# Altium project Medicop.PrjPcb
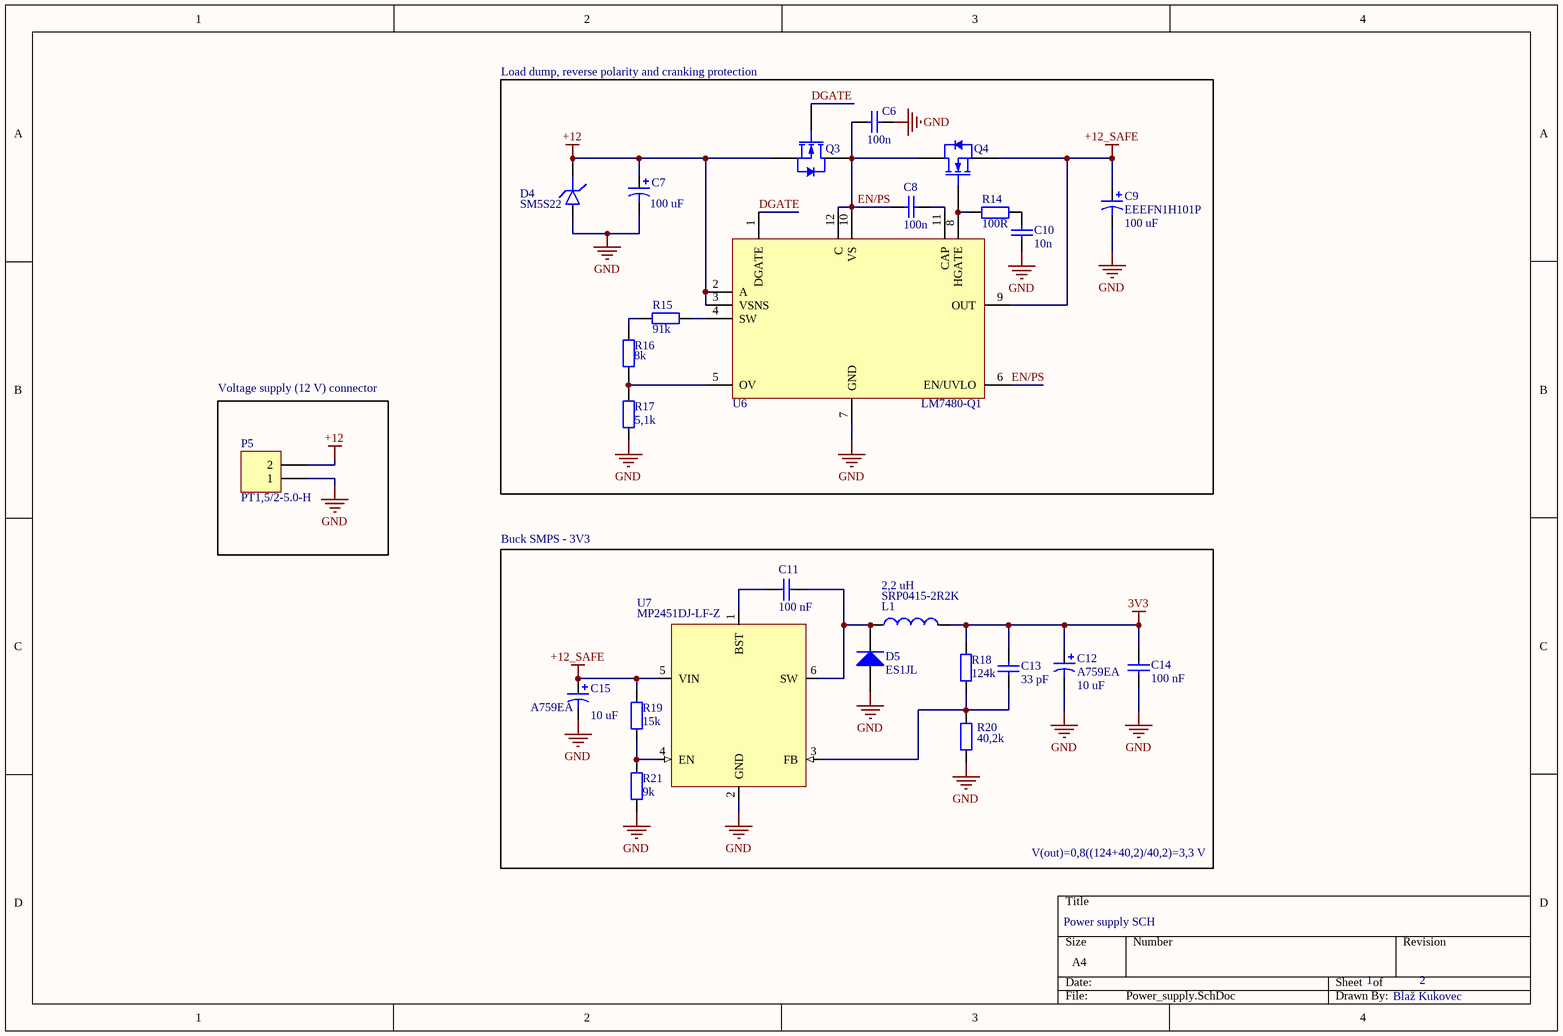
[diagram p0: Power_supply.SchDoc]
2 sheets, 59 parts. Net scope: global (net labels, ports and power ports of the same name join across sheets).
Sheets:
  Power_supply.SchDoc
  Medicop_Schematic.SchDoc

## Sheet Power_supply.SchDoc
size A4

### Parts
C6  value 100n  [C0603[1608]]  (hidden comment: Cap)
C7  value 100 uF  [CAP_FN_F_PAN]  (hidden comment: EEEFN1H101P)
C8  value 100n  [C0603[1608]]  (hidden comment: Cap)
C9  EEEFN1H101P  value 100 uF  [CAP_FN_F_PAN]
C10  value 10n  [C0603[1608]]  (hidden comment: Cap)
C11  value 100 nF  [C0603[1608]]  (hidden comment: Cap)
C12  A759EA  value 10 uF  [A759EA]
C13  value 33 pF  [C0603[1608]]  (hidden comment: Cap)
C14  value 100 nF  [C0603[1608]]  (hidden comment: Cap)
C15  A759EA  value 10 uF  [A759EA]
D4  SM5S22  [DO-218AB_SM_VIS]
D5  ES1JL  [Sub-SMA]
L1  SRP0415-2R2K  value 2,2 uH  [SRP0415]
P5  PT1,5/2-5.0-H  [PT1,5/2-5.0-H]
Q3  BUK7Y4R8-60EX  [SOT669]  (value not drawn)
Q4  BUK7Y4R8-60EX  [SOT669]  (value not drawn)
R14  value 100R  [0603R-GENERIC]  (hidden comment: Res)
R15  value 91k  [R0603[1608]]  (hidden comment: Res)
R16  value 8k  [R0603[1608]]  (hidden comment: Res)
R17  value 5,1k  [R0603[1608]]  (hidden comment: Res)
R18  value 124k  [0603R-GENERIC]  (hidden comment: Res)
R19  value 15k  [R0603[1608]]  (hidden comment: Res)
R20  value 40,2k  [0603R-GENERIC]  (hidden comment: Res)
R21  value 9k  [R0603[1608]]  (hidden comment: Res)
U6  LM7480-Q1  [WSON12]
U7  MP2451DJ-LF-Z  [TSOT-23-6]

### Blocks framed on the sheet
Load dump, reverse polarity and cranking protection: C6-C10 D4 Q3 Q4 R14-R17 U6
Voltage supply (12 V) connector: P5

### Nets
3V3: C12.1 C13.2 C14.2 L1.2 R18.1
+12: C7.1 D4.K P5.2 Q3.3(S) U6.2(A) U6.3(VSNS)
+12_SAFE: C9.1 C15.1 Q4.3(S) R19.2 U6.9(OUT) U7.5(VIN)
GND: C6.1 C7.2 C9.2 C10.1 C12.2 C14.1 C15.2 D4.A D5.1(A) P5.1 R17.1 R20.1 R21.1 U6.7(GND) U7.2(GND)
DGATE: Q3.1(G) U6.1(DGATE)
EN/PS: C6.2 C8.1 Q3.2(D) Q4.2(D) U6.6(EN/UVLO) U6.10(VS) U6.12(C)
NetC8_2: C8.2 U6.11(CAP)
NetC10_2: C10.2 R14.2
NetC11_1: C11.1 D5.2(K) L1.1 U7.6(SW)
NetC11_2: C11.2 U7.1(BST)
NetC13_1: C13.1 R18.2 R20.2 U7.3(FB)
NetQ4_1: Q4.1(G) R14.1 U6.8(HGATE)
NetR15_1: R15.1 U6.4(SW)
NetR15_2: R15.2 R16.2
NetR16_1: R16.1 R17.2 U6.5(OV)
NetR19_1: R19.1 R21.2 U7.4(EN)

### Notes on the sheet
- Buck SMPS - 3V3
- V(out)=0,8((124+40,2)/40,2)=3,3 V
- Power supply SCH
- 1
- 2
- Blaž Kukovec

### Library data of the parts
C6 C8 C10 C11 C13 C14 = Cap: Capacitor; ComponentLink1Description: Supplierlink; ComponentLink2Description: Datasheet
C7 C9 = EEEFN1H101P: SMD Aluminium Electrolytic Capacitor, Radial Can - SMD, 100 µF, 50 V, 0.34 ohm; PacketDescription: TH; ComponentLink1Description: SupplierLink; ComponentLink1URL: https://si.farnell.com/panasonic/eeefn1h101p/cap-100uf-50v-alu-elec-smd/dp/3386217; ComponentLink2Description: Datasheet; ComponentLink2URL: https://www.farnell.com/datasheets/2939503.pdf; Supplier1: Farnell; SupplierPartNumber1: 3386217
C12 C15 = A759EA106M1JAAE060: A759EA106M1JAAE060 - Capacitor - 10 µF - 63 V - Low ESR (60m); PacketDescription: TH; ComponentLink1Description: SupplierLink; ComponentLink1URL: https://si.farnell.com/kemet/a759ea106m1jaae060/cap-10uf-63v-alu-polymer-radial/dp/4071156; ComponentLink2Description: Datasheet; ComponentLink2URL: https://content.kemet.com/datasheets/KEM_A4072_A759.pdf; Supplier1: Farnell; SupplierPartNumber1: 4071156
D4 = SM5S22ATHE3/I: ESD Suppressors / TVS Diodes 5W,22V 5%,SMD PAR AEC-Q101 Qualified; ComponentLink1Description: Supplierlink; PackageDescription: PowerDI123; ComponentLink1URL: https://eu.mouser.com/ProductDetail/Vishay-General-Semiconductor/SM5S22ATHE3-I?qs=Vcr9%2FL0R50gQwdAZT2MpLw%3D%3D; ComponentLink2Description: Datasheet; ComponentLink2URL: https://www.vishay.com/docs/87609/sm5s10atthrusm5s36at.pdf; Supplier1: Mouser; SupplierPartNumber1: 78-SM5S22ATHE3/I
D5 = ES1JL: Ultrafast Diode; ComponentLink1Description: Supplierlink; PackageDescription: Sub SMA; ComponentLink1URL: https://www.tme.eu/sl/details/es1jl/univerzalne-smd-diode/taiwan-semiconductor/; ComponentLink2Description: Datasheet; ComponentLink2URL: https://www.tme.eu/sl/Document/6e3ed172b8ef57eec12ad172948b8283/ES1JL-DTE.pdf; Supplier1: TME; SupplierPartNumber1: https://www.tme.eu/sl/details/es1jl/univerzalne-smd-diode/taiwan-semiconductor/
L1 = SRP0415-2R2K: Power Inductor (SMD), 2.2 µH, 4.2 A, Shielded, 6.5 A, SRP0415; ComponentLink1Description: Supplierlink; PackageDescription: 4,1 x 4,4 mm; ComponentLink1URL: https://si.farnell.com/bourns/srp0415-2r2k/inductor-2-2uh-shielded-4-2a/dp/3410557?st=srp0415-2r2k; ComponentLink2Description: Datasheet; ComponentLink2URL: http://www.farnell.com/datasheets/1780639.pdf?_ga=1.11763974http://www.farnell.com/datasheets/1870377.pdf?_ga=2.97039455.1713077709.1510607325-537448299.1510088633&_gac=1.187392858.1510611497.CjwKCAiAoqXQBRA8EiwAIIOWsuqxOSeUt0rc_qHWWY-BiEXPlEM73fxauWSkJ-z_Lq9BZTEckF83wRoCiNIQAvD_BwE5.938531117.1476279422; Supplier1: Farnell; SupplierPartNumber1: 3410557
P5 = PT1,5/2-5.0-H: Wire-To-Board Terminal Block, 5 mm, 2 Ways, 1.5 mm²; ComponentLink1Description: SupplierLink; ComponentLink1URL: https://si.farnell.com/phoenix-contact/pt1-5-2-5-0-h/terminal-block-wire-to-brd-2pos/dp/1793674?st=pt1,5; ComponentLink2Description: Datasheet; ComponentLink2URL: http://www.farnell.com/datasheets/2325505.pdf; Supplier1: Farnell; SupplierPartNumber1: 1793674
Q3 Q4 = BUK7Y4R8-60EX: Power MOSFET, N Channel, 60 V, 100 A, 0.0029 ohm, LFPAK56, Surface Mount; ComponentLink1Description: Supplierlink; PackageDescription: SOT669; ComponentLink1URL: https://si.farnell.com/nexperia/buk7y4r8-60ex/mosfet-aecq101-n-ch-60v-100a-lfpak56/dp/3439679?st=buk7y4r8-60e; ComponentLink2Description: Datasheet; ComponentLink2URL: https://4donline.ihs.com/images/VipMasterIC/IC/NEXP/NEXP-S-A0003060256/NEXP-S-A0003059997-1.pdf?hkey=6D3A4C79FDBF58556ACFDE234799DDF0; Supplier1: Farnell; SupplierPartNumber1: 3439679
R14-R21 = Res: Resistor; ComponentLink1Description: Supplierlink; ComponentLink2Description: Datasheet
U6 = LM7480-Q1: Power Management Specialised - PMIC 3-V to 65-V, automotive ideal diode controller driving back to back NFETs 12-WSON -40 to 125; ComponentLink1Description: Supplierlink; PackageDescription: WSON-12; ComponentLink1URL: https://eu.mouser.com/ProductDetail/Texas-Instruments/LM74801QDRRRQ1?qs=zW32dvEIR3uHxOfYWHY8FQ%3D%3D; ComponentLink2Description: Datasheet; ComponentLink2URL: https://www.ti.com/lit/ds/symlink/lm7480-q1.pdf?HQS=dis-mous-null-mousermode-dsf-pf-null-wwe&ts=1693805776578&ref_url=https%253A%252F%252Fwww.mouser.cn%252F; Supplier1: Mouser; SupplierPartNumber1: 595-LM74801QDRRRQ1
U7 = MP2451DJ-LF-Z: DC-DC Switching Buck (Step Down) Regulator, 3.3V-36V in, 800mV to 28.8V out, 600mA, 2MHz, TSOT-23-6; ComponentLink1Description: Supplierlink; PackageDescription: TSOT-23-6; ComponentLink1URL: https://si.farnell.com/monolithic-power-systems-mps/mp2451dj-lf-z/dc-dc-conv-sync-buck-2mhz-125degc/dp/3357997; ComponentLink2Description: Datasheet; ComponentLink2URL: https://www.farnell.com/datasheets/2914802.pdf; Supplier1: Farnell; SupplierPartNumber1: 3357997

## Sheet Medicop_Schematic.SchDoc
size A4
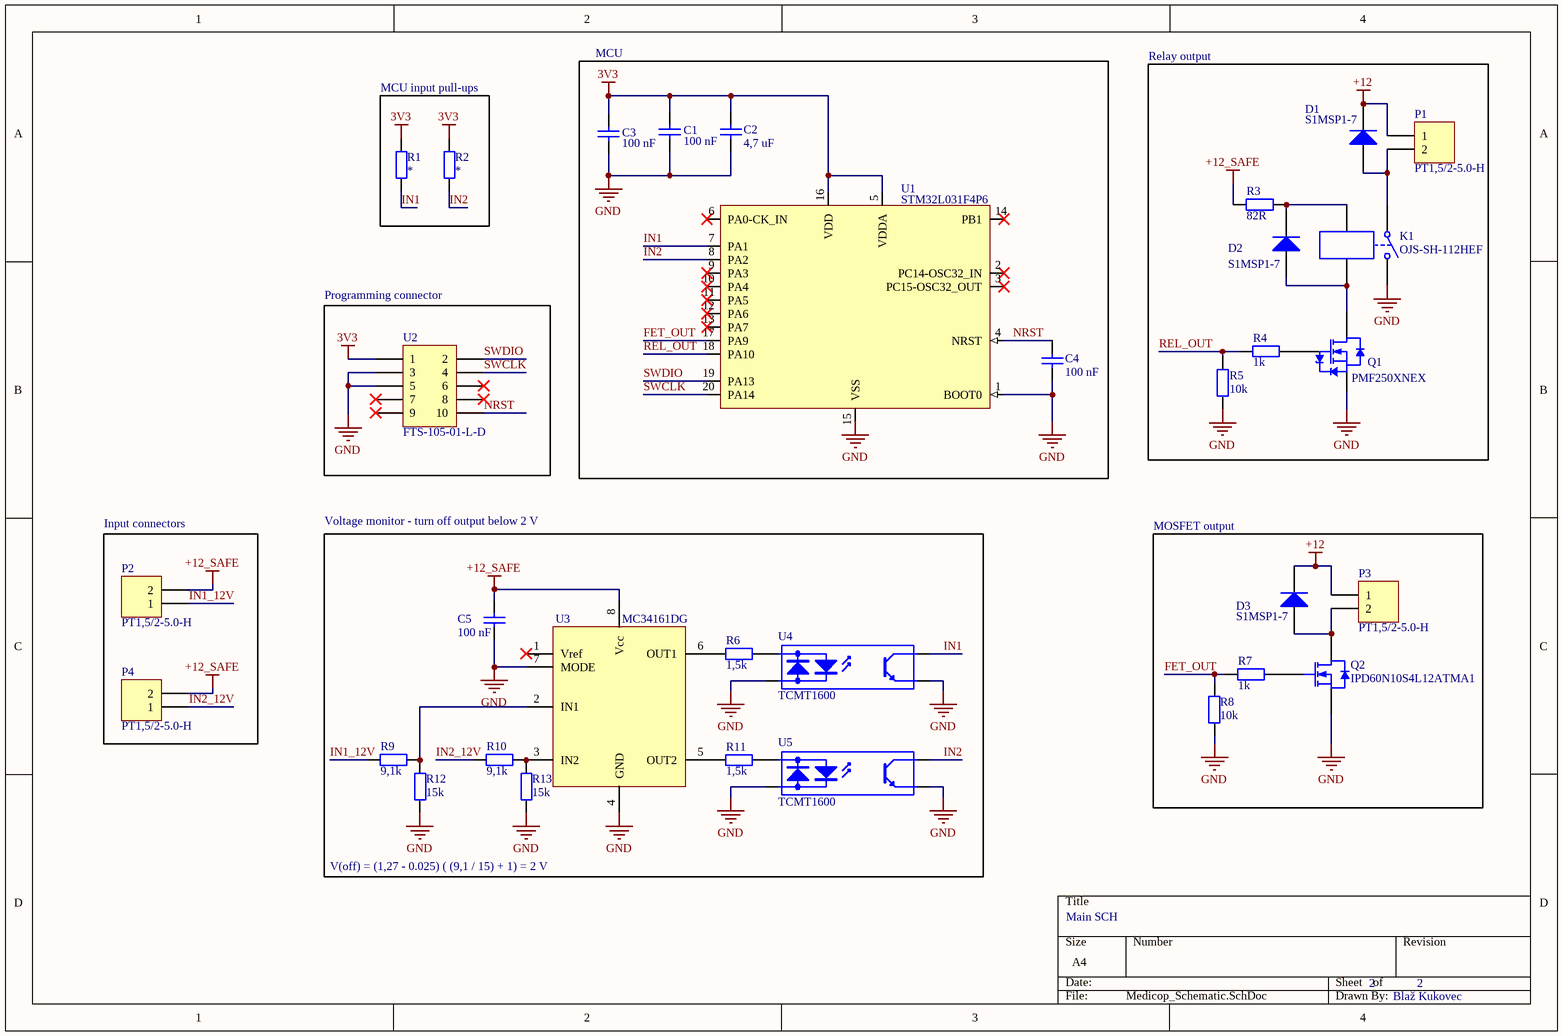
[diagram p1: Medicop_Schematic.SchDoc]

### Parts
C1  value 100 nF  [C0603[1608]]  (hidden comment: Cap)
C2  value 4,7 uF  [C0603[1608]]  (hidden comment: Cap)
C3  value 100 nF  [C0603[1608]]  (hidden comment: Cap)
C4  value 100 nF  [C0603[1608]]  (hidden comment: Cap)
C5  value 100 nF  [C0603[1608]]  (hidden comment: Cap)
D1  S1MSP1-7  [PowerDI123]
D2  S1MSP1-7  [PowerDI123]
D3  S1MSP1-7  [PowerDI123]
K1  OJS-SH-112HEF
P1  PT1,5/2-5.0-H  [PT1,5/2-5.0-H]
P2  PT1,5/2-5.0-H  [PT1,5/2-5.0-H]
P3  PT1,5/2-5.0-H  [PT1,5/2-5.0-H]
P4  PT1,5/2-5.0-H  [PT1,5/2-5.0-H]
Q1  PMF250XNEX  [SC-70 (SOT323)]
Q2  IPD60N10S4L12ATMA1  [DPAK (TO-252)]
R1  Res  [R0603[1608]]  (value not drawn)
R2  Res  [R0603[1608]]  (value not drawn)
R3  value 82R  [R1206[3216]]  (hidden comment: Res)
R4  value 1k  [R0603[1608]]  (hidden comment: Res)
R5  value 10k  [R0603[1608]]  (hidden comment: Res)
R6  value 1,5k  [R1206[3216]]  (hidden comment: Res)
R7  value 1k  [R0603[1608]]  (hidden comment: Res)
R8  value 10k  [R0603[1608]]  (hidden comment: Res)
R9  value 9,1k  [R0603[1608]]  (hidden comment: Res)
R10  value 9,1k  [R0603[1608]]  (hidden comment: Res)
R11  value 1,5k  [R1206[3216]]  (hidden comment: Res)
R12  value 15k  [R0603[1608]]  (hidden comment: Res)
R13  value 15k  [R0603[1608]]  (hidden comment: Res)
U1  STM32L031F4P6  [TSSOP-20]
U2  FTS-105-01-L-D  [CON10_2x5_TU_FTS_SAI]
U3  MC34161DG  [SOIC-8]
U4  TCMT1600  [SOP-4]
U5  TCMT1600  [SOP-4]

### Blocks framed on the sheet
Relay output: D1 D2 K1 P1 Q1 R3-R5
MCU input pull-ups: R1 R2
Programming connector: U2
Input connectors: P2 P4
MOSFET output: D3 P3 Q2 R7 R8

### Nets
3V3: C1.2 C2.2 C3.2 R1.2 R2.2 U1.5(VDDA) U1.16(VDD) U2.1
+12: D1.2(K) D3.2(K) P1.1 P3.1
+12_SAFE: C5.2 P2.2 P4.2 R3.2 U3.8(Vcc)
GND: C1.1 C2.1 C3.1 C4.1 C5.1 K1.2 Q1.2(S) Q2.3(S) R5.1 R8.2 R12.1 R13.1 U1.1(BOOT0) U1.15(VSS) U2.3 U2.5 U3.4(GND) U3.7(MODE) U4.2(K) U4.3(E) U5.2(K) U5.3(E)
FET_OUT: R7.1 R8.1 U1.17(PA9)
IN1: R1.1 U1.7(PA1) U4.4(C)
IN1_12V: P2.1 R9.2
IN2: R2.1 U1.8(PA2) U5.4(C)
IN2_12V: P4.1 R10.2
NRST: C4.2 U1.4(NRST) U2.10
REL_OUT: R4.2 R5.2 U1.18(PA10)
SWCLK: U1.20(PA14) U2.4
SWDIO: U1.19(PA13) U2.2
NetD1_1: D1.1(A) K1.1 P1.2
NetD2_1: D2.1(A) K1.4 Q1.3(D)
NetD2_2: D2.2(K) K1.3 R3.1
NetD3_1: D3.1(A) P3.2 Q2.2(D)
NetQ1_1: Q1.1(G) R4.1
NetQ2_1: Q2.1(G) R7.2
NetR6_1: R6.1 U3.6(OUT1)
NetR6_2: R6.2 U4.1(A)
NetR9_1: R9.1 R12.2 U3.2(IN1)
NetR10_1: R10.1 R13.2 U3.3(IN2)
NetR11_1: R11.1 U3.5(OUT2)
NetR11_2: R11.2 U5.1(A)

Not connected (* = marked no-connect by the designer): U1 2(PC14-OSC32_IN)* 3(PC15-OSC32_OUT)* 6(PA0-CK_IN)* 9(PA3)* 10(PA4)* 11(PA5)* 12(PA6)* 13(PA7)* 14(PB1)*; U2 6* 7* 8* 9*; U3 1(Vref)*

### Notes on the sheet
- MCU
- Voltage monitor - turn off output below 2 V
- V(off) = (1,27 - 0.025) ( (9,1 / 15) + 1) = 2 V
- Main SCH
- 2
- Blaž Kukovec

### Library data of the parts
C1-C5 = Cap: Capacitor; ComponentLink1Description: Supplierlink; ComponentLink2Description: Datasheet
D1-D3 = S1MSP1-7: S1MSP1-7 -  Standard Power Diode; ComponentLink1Description: Supplierlink; PackageDescription: PowerDI123; ComponentLink1URL: http://si.farnell.com/diodes-inc/s1msp1-7/rectifier-single-1kv-1a-powerdi123/dp/2709563?ost=2709563&iscrfnonsku=false&ddkey=http%3Asl-SL%2FElement14_Slovenia%2Fsearch; ComponentLink2Description: Datasheet; ComponentLink2URL: http://www.farnell.com/datasheets/2211407.pdf?_ga=2.218430301.595311603.1510137230-1866036872.1506721459&_gac=1.149546820.1509893228.CjwKCAjw7frPBRBVEiwAuDf_LXlrjw5vBXiuyKtw25GuiPLDKV5cnVdEcFzcF753v9PaBj8Hg6kd-RoC_yYQAvD_BwE; Supplier1: Farnell; SupplierPartNumber1: 2709563
K1 = OJS-SH-112HEF: Power Relay, SPST-NO, 12 VDC, 16 A, OJS, Through Hole, Non Latching; ComponentLink1Description: Supplierlink; PackageDescription: /; ComponentLink1URL: https://si.farnell.com/te-connectivity-oeg/2071556-3/power-relay-spst-no-12vdc-16a/dp/3764768; ComponentLink2Description: Datasheet; ComponentLink2URL: https://www.farnell.com/datasheets/3212368.pdf; Supplier1: Farnell; SupplierPartNumber1: 3764768
P1-P4 = PT1,5/2-5.0-H: as P5 on sheet Power_supply; ComponentLink1Description: SupplierLink; ComponentLink1URL: https://si.farnell.com/phoenix-contact/pt1-5-2-5-0-h/terminal-block-wire-to-brd-2pos/dp/1793674?st=pt1,5; ComponentLink2Description: Datasheet; ComponentLink2URL: http://www.farnell.com/datasheets/2325505.pdf; Supplier1: Farnell; SupplierPartNumber1: 1793674
Q1 = PMF250XNEX: Power MOSFET, N Channel, 30 V, 900 mA, 0.212 ohm; ComponentLink1Description: Supplierlink; PackageDescription: SC-70; ComponentLink1URL: https://si.farnell.com/nexperia/pmf250xnex/mosfet-n-ch-30v-0-9a-sc-70/dp/3440055; ComponentLink2Description: Datasheet; ComponentLink2URL: https://4donline.ihs.com/images/VipMasterIC/IC/NEXP/NEXP-S-A0003105620/NEXP-S-A0003100993-1.pdf?hkey=6D3A4C79FDBF58556ACFDE234799DDF0; Supplier1: Farnell; SupplierPartNumber1: 3440055
Q2 = IPD60N10S4L12ATMA1: Power MOSFET, N Channel, 100 V, 60 A, 0.0098 ohm, TO-252 (DPAK), Surface Mount; ComponentLink1Description: Supplierlink; PackageDescription: TO-252 (DPAK); ComponentLink1URL: https://si.farnell.com/infineon/ipd60n10s4l12atma1/mosfet-aec-q101-n-ch-100v-to-252/dp/2725850; ComponentLink2Description: Datasheet; ComponentLink2URL: https://4donline.ihs.com/images/VipMasterIC/IC/INFN/INFNS28006/INFNS28006-1.pdf?hkey=6D3A4C79FDBF58556ACFDE234799DDF0; Supplier1: Farnell; SupplierPartNumber1: 2725850
R1-R13 = Res: Resistor; ComponentLink1Description: Supplierlink; ComponentLink2Description: Datasheet
  R1 R2: Value: *
U1 = STM32L031F4P6: Access line ultra-low-power 32-bit MCU Arm®-based / Cortex®-M0+, up to 32KB Flash, 8KB SRAM, 1KB EEPROM, ADC; ComponentLink1Description: Supplierlink; PackageDescription: TSSOP; ComponentLink1URL: https://si.farnell.com/stmicroelectronics/stm32l031f4p6/mcu-arm-cortex-m0-32mhz-tssop/dp/2770299?gclid=Cj0KCQjwgNanBhDUARIsAAeIcAsvU6dmqvMp5MVE-0sNDLjaUK4LtGccWXp1TXJz6kN2eYlTZZ089QkaAo1SEALw_wcB&mckv=sMuoSKpXF_dc|pcrid|289561886841|kword|stm32l031f4p6|match|p|plid||slid||product||pgrid|35804823499|ptaid|aud-913880707580:kwd-530299959512|&CMP=KNC-GSI-GEN-SKU-G50-STMICROELECTRONICS-0617; ComponentLink2Description: Datasheet; ComponentLink2URL: https://4donline.ihs.com/images/VipMasterIC/IC/SGST/SGST-S-A0002219924/SGST-S-A0002219924-1.pdf?hkey=6D3A4C79FDBF58556ACFDE234799DDF0; Supplier1: Farnell; SupplierPartNumber1: 2770299
U2 = FTS-105-01-L-D: Pin Header, Wire-to-Board, 1.27 mm, 2 Rows, 10 Contacts, Through Hole, FTS; ComponentLink1Description: Supplierlink; PackageDescription: 2x5, 1,27; ComponentLink1URL: https://si.farnell.com/samtec/fts-105-01-l-d/header-1-27mm-thru-hole-10way/dp/1667728; ComponentLink2Description: Datasheet; ComponentLink2URL: https://www.farnell.com/datasheets/2045594.pdf; Supplier1: Farnell; SupplierPartNumber1: 1667728
U3 = MC34161DG: Voltage Monitor, 2 Monitors, 2 V to 40 V Supply, 1.27 V Threshold, Active-Low, MSOP-8; ComponentLink1Description: Supplierlink; PackageDescription: SOIC-8; ComponentLink1URL: https://si.farnell.com/on-semiconductor/mc34161dmr2g/voltage-monitor-1-27v-micro-8/dp/2774746; ComponentLink2Description: Datasheet; ComponentLink2URL: https://4donline.ihs.com/images/VipMasterIC/IC/ONSM/ONSM-S-A0016027427/ONSM-S-A0016015098-1.pdf?hkey=6D3A4C79FDBF58556ACFDE234799DDF0/2001832.pdf; Supplier1: Farnell; SupplierPartNumber1: 2774746
U4 U5 = TCMT1600: ComponentLink1Description: Supplierlink; ComponentLink1URL: http://si.farnell.com/vishay/tcmt1600/optocoupler-transistor-o-p/dp/1469543?st=TCMT1600; ComponentLink2Description: Datasheet; ComponentLink2URL: http://www.farnell.com/datasheets/2049331.pdf?_ga=2.51402858.2976559.1516799392-1866036872.1506721459&_gac=1.247281142.1515412736.Cj0KCQiAyszSBRDJARIsAHAqQ4p5R3qZ2qs70hZPKglejP0cEAb9a5kdz8rr1XWlOilTbtuGZnZjed8aApCDEALw_wcB; Supplier1: Farnell; SupplierPartNumber1: 1469543

## Nets that join several sheets
3V3: Power_supply (5 pins), Medicop_Schematic (8 pins)
+12: Power_supply (6 pins), Medicop_Schematic (D1.2 D3.2 P1.1 P3.1)
+12_SAFE: Power_supply (6 pins), Medicop_Schematic (5 pins)
GND: Power_supply (15 pins), Medicop_Schematic (22 pins)